# EAGLE design Project (EAGLE 8.7.0)
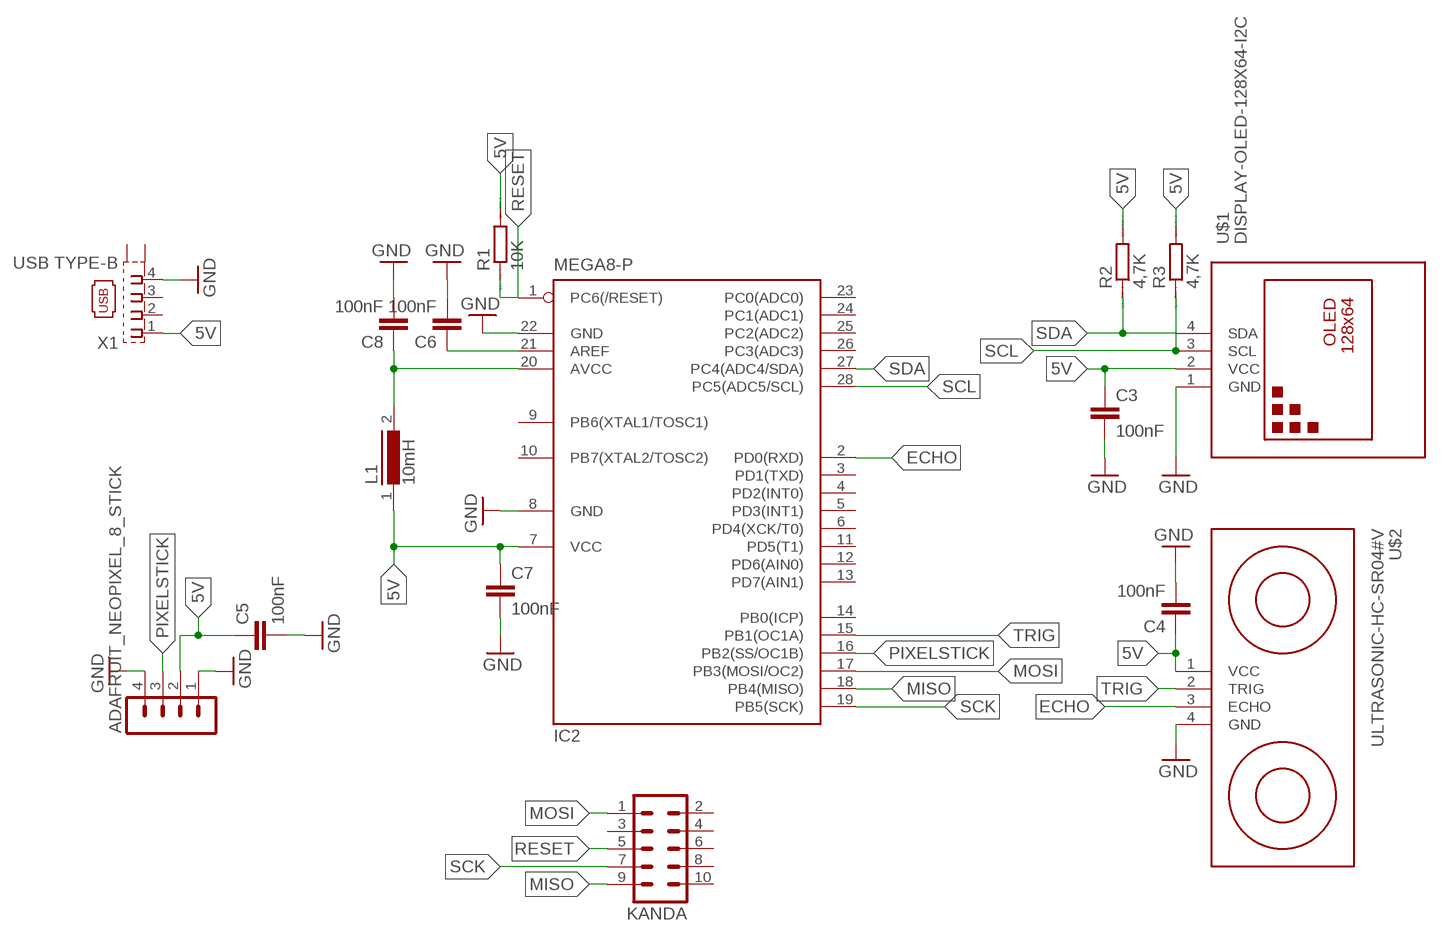
[diagram p0: schematic, sheet 1]

## Parts
ADAFRUIT_NEOPIXEL_8_STICK  MA04-1  [MA04-1]
C3  100nF  C-EU025-024X044  [C025-024X044]
C4  100nF  C-EU025-024X044  [C025-024X044]
C5  100nF  C-EU025-024X044  [C025-024X044]
C6  100nF  C-EU025-024X044  [C025-024X044]
C7  100nF  C-EU025-024X044  [C025-024X044]
C8  100nF  C-EU025-024X044  [C025-024X044]
IC2  MEGA8-P  [DIL28-3]
KANDA  ML10  [ML10]
L1  10mH  A26GFC  [A26GFC]
R1  10K  R  [R0805]
R2  4,7K  R  [R0805]
R3  4,7K  R  [R0805]
U$1  DISPLAY-OLED-128X64-I2C  [DISPLAY-OLED-128X64-I2C]
U$2  ULTRASONIC-HC-SR04#V  [ULTRASONIC-HC-SR04#V]
X1  USB TYPE-B  KUSBVX-BS1N  [KUSBVX-BS1N]

## Nets
5V: ADAFRUIT_NEOPIXEL_8_STICK.2 C3.1 C4.1 C5.1 C7.1 IC2.7(VCC) L1.1 R1.2 R2.2 R3.2 U$1.2(VCC) U$2.1(VCC) X1.1
ECHO: IC2.2(PD0(RXD)) U$2.3(ECHO)
GND: ADAFRUIT_NEOPIXEL_8_STICK.1 ADAFRUIT_NEOPIXEL_8_STICK.4 C3.2 C4.2 C5.2 C6.2 C7.2 C8.2 IC2.8(GND) IC2.22(GND) U$1.1(GND) U$2.4(GND) X1.4
MISO: IC2.18(PB4(MISO)) KANDA.9
MOSI: IC2.17(PB3(MOSI/OC2)) KANDA.1
N$8: C8.1 IC2.20(AVCC) L1.2
N$12: C6.1 IC2.21(AREF)
PIXELSTICK: ADAFRUIT_NEOPIXEL_8_STICK.3 IC2.16(PB2(SS/OC1B))
RESET: IC2.1(PC6(/RESET)) KANDA.5 R1.1
SCK: IC2.19(PB5(SCK)) KANDA.7
SCL: IC2.28(PC5(ADC5/SCL)) R3.1 U$1.3(SCL)
SDA: IC2.27(PC4(ADC4/SDA)) R2.1 U$1.4(SDA)
TRIG: IC2.15(PB1(OC1A)) U$2.2(TRIG)
Unconnected: IC2.3(PD1(TXD)) IC2.4(PD2(INT0)) IC2.5(PD3(INT1)) IC2.6(PD4(XCK/T0)) IC2.9(PB6(XTAL1/TOSC1)) IC2.10(PB7(XTAL2/TOSC2)) IC2.11(PD5(T1)) IC2.12(PD6(AIN0)) IC2.13(PD7(AIN1)) IC2.14(PB0(ICP)) IC2.23(PC0(ADC0)) IC2.24(PC1(ADC1)) IC2.25(PC2(ADC2)) IC2.26(PC3(ADC3)) KANDA.2 KANDA.3 KANDA.4 KANDA.6 KANDA.8 KANDA.10 X1.2 X1.3 X1.M1(S1) X1.M2(S2)

## Library data of the parts
ADAFRUIT_NEOPIXEL_8_STICK = con-lstb:MA04-1: PIN HEADER; OC_FARNELL: unknown; OC_NEWARK: unknown
C3-C8 = rcl:C-EU: CAPACITOR, European symbol; SPICEPREFIX: C
IC2 = atmel:MEGA8-P: MICROCONTROLLER 8 Kbytes FLASH, 1 kbytes SRAM, 512 bytes EEPROM, USART, 4-channel 10 bit ADC, 2-channel 8 bit ADC Pin compatible with Atmega48, ATMega88, ATMega168 Source: avr.lbr; OC_FARNELL: unknown; OC_NEWARK: unknown
KANDA = con-ml:ML10: HARTING; OC_FARNELL: unknown; OC_NEWARK: unknown
L1 = inductors:A26GFC: INDUCTOR; SPICEPREFIX: L
R1-R3 = eagle-ltspice:R: RESISTOR, European symbol; SPICEMODEL: NONE; SPICEPREFIX: R
U$1 = diy-modules:DISPLAY-OLED-128X64-I2C: 128x64 Dot Matrix OLED Module based on SSD1306 chip Variant with I2C interface More details available here: http://www.instructables.com/id/Monochrome-096-i2c-OLED-display-with-arduino-SSD13/ SSD1306 datasheet: https://cdn-shop.adafruit.com/datasheets/SSD1306.pdf Click here to find device on ebay.com <http://www.ebay.com/sch/oled+display+128x64+iic> Note: There are two variants: I2C and SPI. Search for the proper version.
U$2 = diy-modules:ULTRASONIC-HC-SR04: Ultrasonic Ranging Module HC-SR04 More details available here: http://randomnerdtutorials.com/complete-guide-for-ultrasonic-sensor-hc-sr04/ Click here to find device on ebay.com <http://www.ebay.com/sch/hc+sr04+ultrasonic>
X1 = con-kycon:KUSBVX-BS1N: USB B-type Receptacle Vertical, 4 Position, Through Hole Source: Sibalco Kycon KUSBVX-BS1N-xxx.pdf

## Board
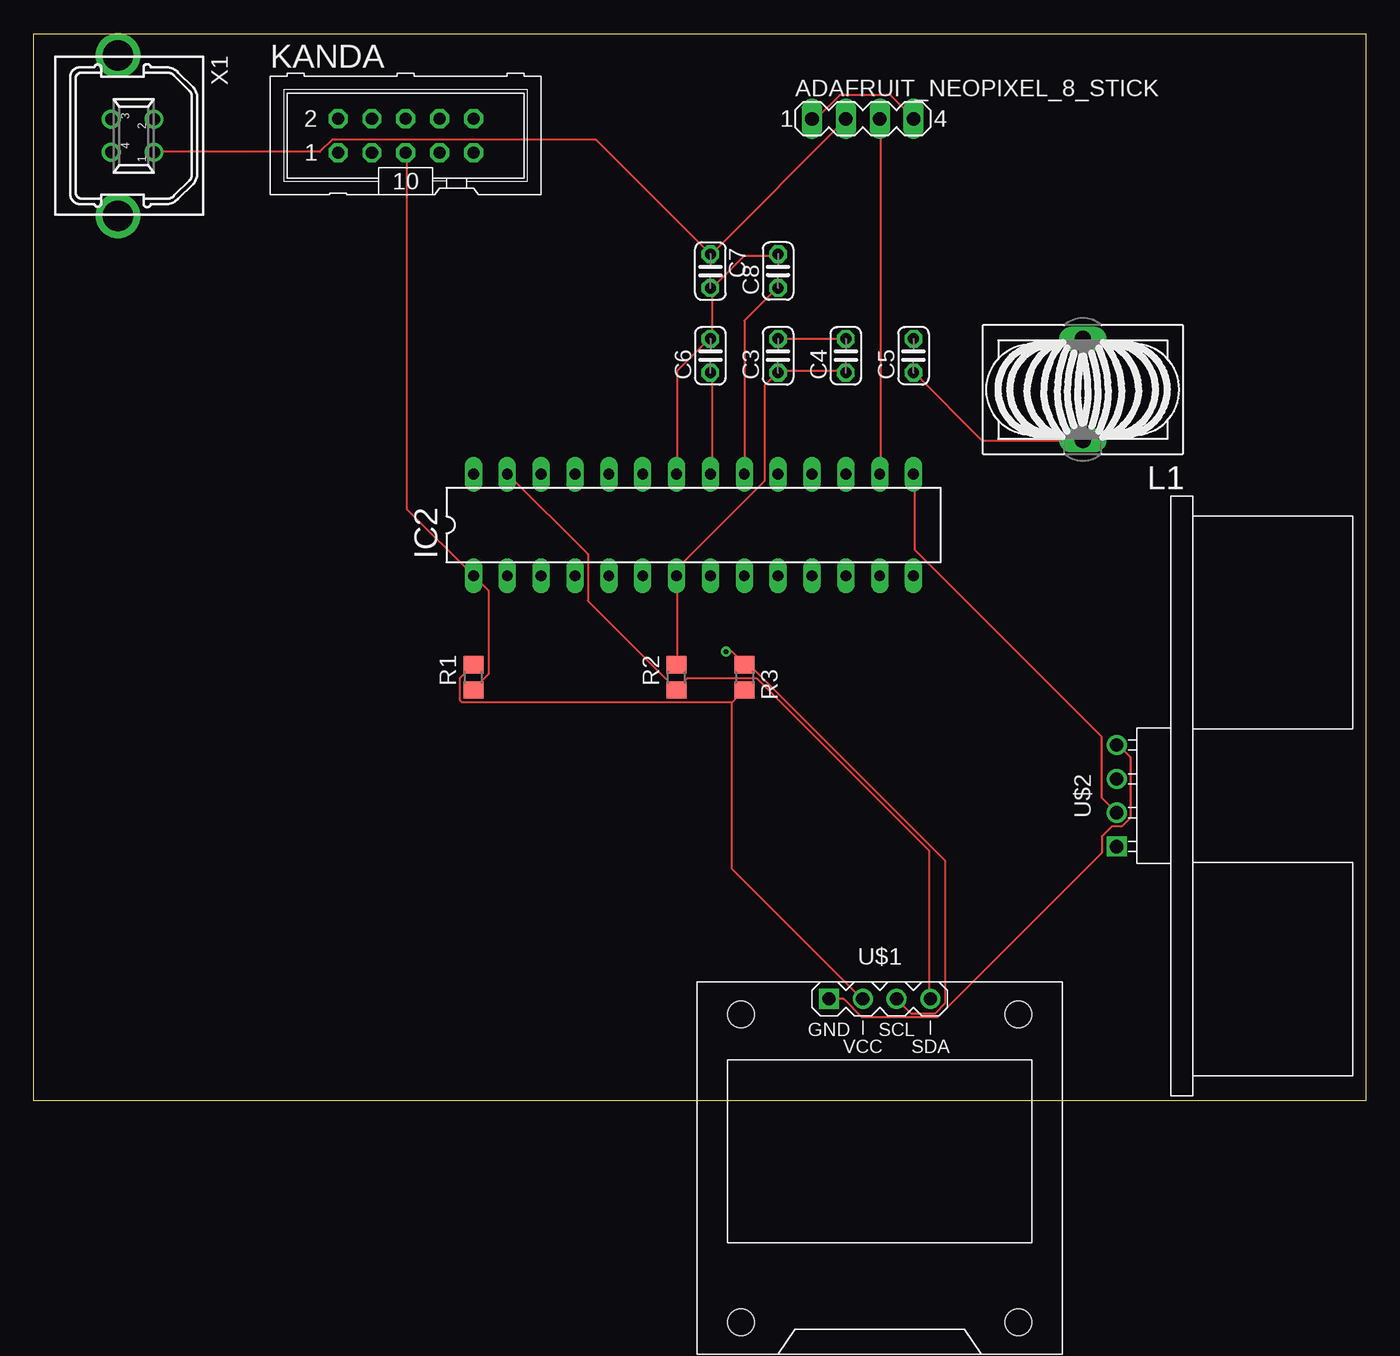
[diagram p1: board, top side]
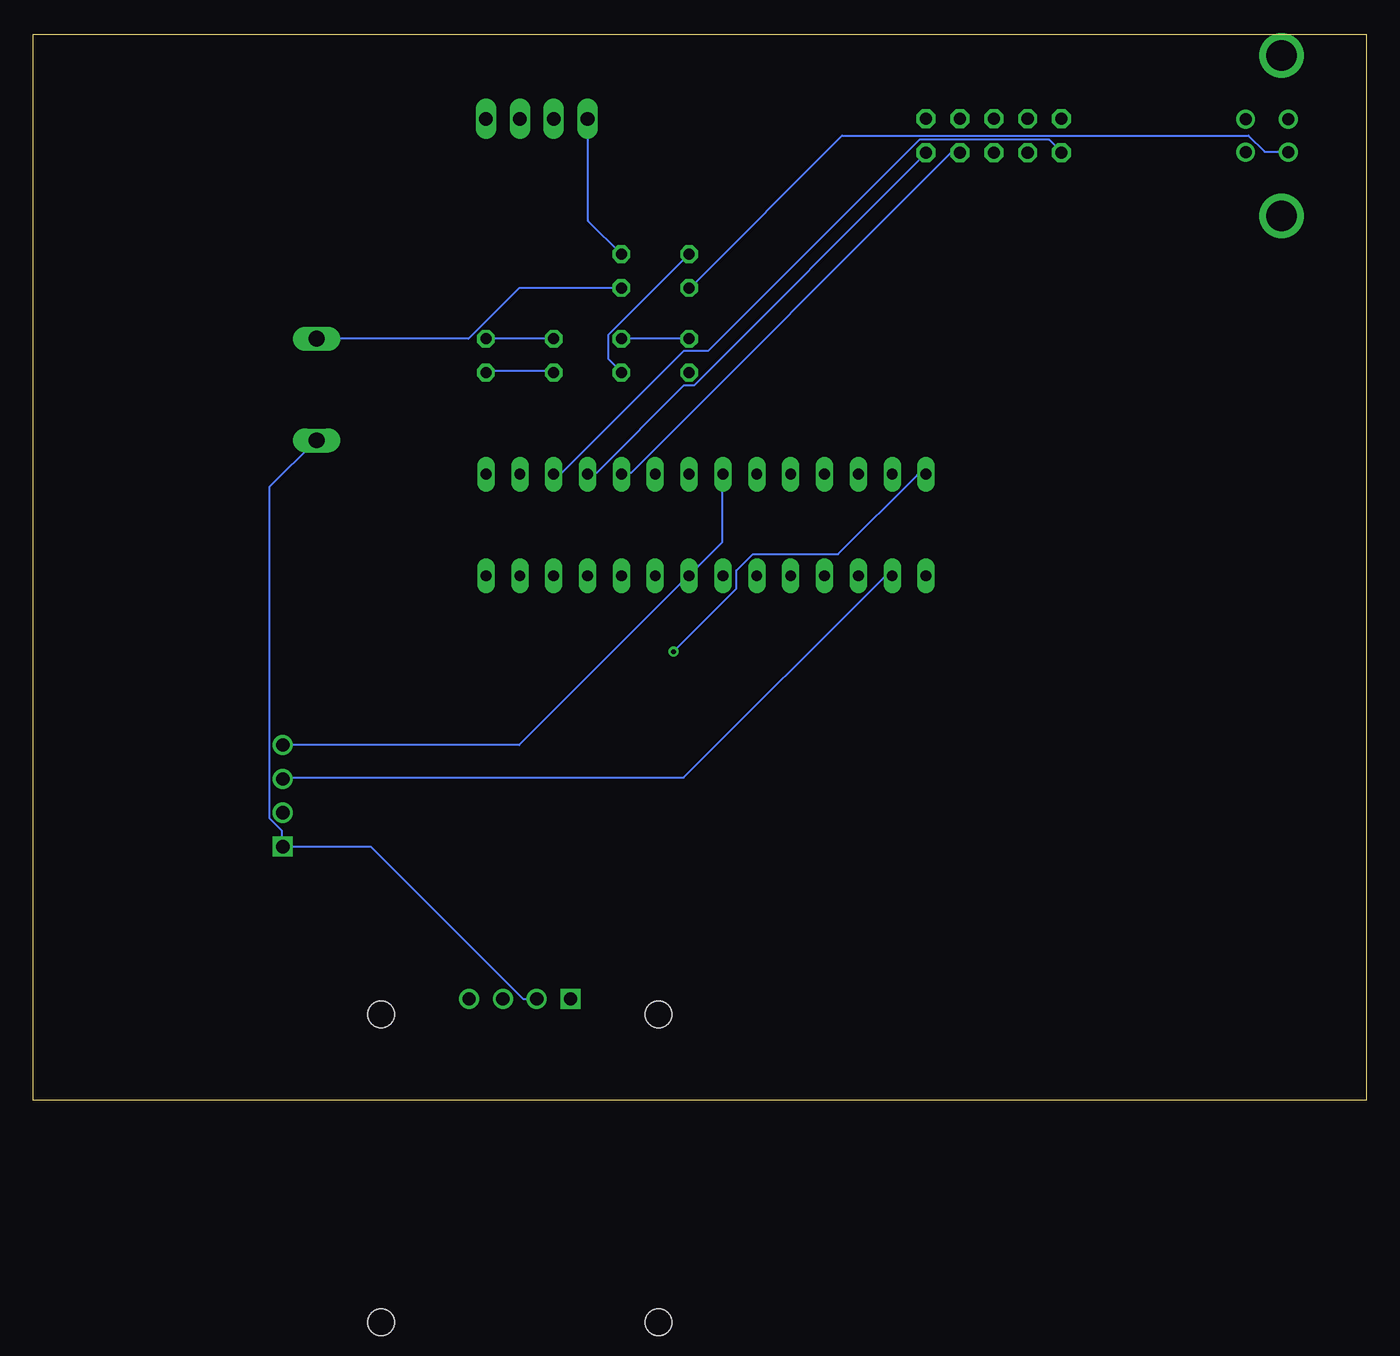
[diagram p2: board, bottom side, seen from below]

Size 100 x 80 mm. Coordinates in mm from the lower left corner, seen from the top.
Outline: 0,0 100,0 100,80 0,80 0,0
Copper layers (1*16): Top 0.035mm / dielectric 1.5mm / Bottom 0.035mm
Design rules "default": minimum track width 6mil, minimum drill 0.35mm, track to track 6mil, track to pad 6mil, pad to pad 6mil, via to via 6mil, smd to smd 6mil, copper to edge 40mil, drill to drill 6mil, minimum pad ring 10mil, minimum via ring 8mil, stop-mask expansion 4mil, vias tented up to drill 0mil, thermal gap 10mil

### Footprints (pad centres in the part's own frame; a part is rotated, then mirrored left to right if it is on the bottom)
MA04-1 = drill 1.016 long: 1 -3.81,0; 2 -1.27,0; 3 1.27,0; 4 3.81,0
C025-024X044 = drill 0.813 octagon: 1 -1.27,0; 2 1.27,0
DIL28-3 = drill 0.813 long: 1 -16.51,-3.81; 2 -13.97,-3.81; 3 -11.43,-3.81; 4 -8.89,-3.81; 5 -6.35,-3.81; 6 -3.81,-3.81; 7 -1.27,-3.81; 8 1.27,-3.81; 9 3.81,-3.81; 10 6.35,-3.81; 11 8.89,-3.81; 12 11.43,-3.81; 13 13.97,-3.81; 14 16.51,-3.81; 15 16.51,3.81; 16 13.97,3.81; 17 11.43,3.81; 18 8.89,3.81; 19 6.35,3.81; 20 3.81,3.81; 21 1.27,3.81; 22 -1.27,3.81; 23 -3.81,3.81; 24 -6.35,3.81; 25 -8.89,3.81; 26 -11.43,3.81; 27 -13.97,3.81; 28 -16.51,3.81
ML10 = drill 0.914 octagon: 1 -5.08,-1.27; 2 -5.08,1.27; 3 -2.54,-1.27; 4 -2.54,1.27; 5 0,-1.27; 6 0,1.27; 7 2.54,-1.27; 8 2.54,1.27; 9 5.08,-1.27; 10 5.08,1.27
A26GFC = drill 1.194 long: 1 0,3.81; 2 0,-3.81
R0805 = smd 1.3 x 1.5: 1 -0.95,0; 2 0.95,0
DISPLAY-OLED-128X64-I2C = drill 1 square: 1 -3.81,12.7 | drill 1: 2 -1.27,12.7; 3 1.27,12.7; 4 3.81,12.7 | hole 2: -10.414,11.557; 10.414,11.557; 10.414,-11.557; -10.414,-11.557
ULTRASONIC-HC-SR04#V = drill 1 square: 1 -3.81,0 | drill 1: 2 -1.27,0; 3 1.27,0; 4 3.81,0
KUSBVX-BS1N = drill 0.9 pad 1.422: 1 1.25,2.7; 2 -1.25,2.7; 3 -1.25,-0.5; 4 1.25,-0.5 | drill 2.3 pad 2.7: M1 -6.02,0; M2 6.02,0

### Placement (x,y rotation side)
ADAFRUIT_NEOPIXEL_8_STICK  62.23,73.66 0 top
C3  55.88,55.88 90 top
C4  60.96,55.88 90 top
C5  66.04,55.88 90 top
C6  50.8,55.88 90 top
C7  50.8,62.23 270 top
C8  55.88,62.23 90 top
IC2  49.53,43.18 0 top
KANDA  27.94,72.39 0 top
L1  78.74,53.34 180 top
R1  33.02,31.75 90 top
R2  48.26,31.75 90 top
R3  53.34,31.75 270 top
U$1  63.5,-5.08 0 top
U$2  81.28,22.86 90 top
X1  6.35,72.39 270 top

### Tracks (layer width: path | path; a pad name or v marks a point on that pad's centre or on a via)
5V
  Top 0.152: 52.43,29.87 32.16,29.87 32,30.02 32,31.7 32.92,32.61 R1.2 | 52.43,29.87 53.34,30.79 R3.2 | 52.43,29.87 52.43,17.37 62.18,7.62 U$1.2 | R2.2 48.31,32.77 48.31,39.32 IC2.7 48.31,39.47 48.31,39.93 54.86,46.48 54.86,53.65 55.78,54.56 C3.1 55.93,54.71 60.96,54.71 C4.1 | X1.1 9.14,71.17 21.49,71.17 22.4,72.08 42.22,72.08 C7.1 50.9,63.55 60.96,73.61 ADAFRUIT_NEOPIXEL_8_STICK.2 | L1.1 71.17,49.53 66.14,54.56 C5.1
  Bottom 0.152: U$1.2 63.25,7.62 74.68,19.05 U$2.1 81.38,19.05 81.38,20.27 82.3,21.18 82.3,46.02 78.79,49.53 L1.1 | C7.1 56.84,57.45 56.84,55.63 55.93,54.71 C3.1 | C5.1 65.99,54.71 60.96,54.71 C4.1
ECHO
  Bottom 0.152: IC2.2 35.66,39.32 36.12,39.32 51.21,24.23 81.23,24.23 U$2.3
GND
  Top 0.152: U$1.1 60.81,7.62 62.18,6.25 67.82,6.25 80.16,18.59 80.16,19.81 80.92,20.57 81.69,20.57 82.3,21.18 82.3,25.76 81.38,26.67 U$2.4 | ADAFRUIT_NEOPIXEL_8_STICK.1 58.52,73.76 58.83,73.76 60.5,75.44 64.31,75.44 65.99,73.76 ADAFRUIT_NEOPIXEL_8_STICK.4 | 50.9,60.96 50.9,57.15 C6.2 50.75,57.15 48.31,54.71 48.31,47.09 IC2.22 | 50.9,60.96 53.34,63.4 55.78,63.4 C8.2 | 50.9,60.96 C7.2 | C3.2 C4.2
  Bottom 0.152: IC2.22 48.31,46.94 48.31,41.91 50.75,39.47 IC2.8 50.9,39.32 63.55,26.67 U$2.4 | C6.2 C3.2 | C4.2 C5.2 | X1.4 5.94,71.17 7.62,71.17 8.84,72.39 39.32,72.39 50.75,60.96 C7.2 | C8.2 58.37,65.99 58.37,73.61 ADAFRUIT_NEOPIXEL_8_STICK.1
MISO
  Bottom 0.152: IC2.18 58.37,47.09 57.76,47.09 51.21,53.65 50.44,53.65 33.07,71.02 KANDA.9
MOSI
  Bottom 0.152: IC2.17 60.96,47.09 60.35,47.09 51.21,56.24 49.38,56.24 33.53,72.08 23.77,72.08 22.86,71.17 KANDA.1
N$8
  Top 0.152: IC2.20 53.34,58.52 55.78,60.96 C8.1
  Bottom 0.152: L1.2 67.36,57.15 63.55,60.96 C8.1
N$12
  Top 0.152: IC2.21 50.9,47.09 50.9,54.56 C6.1
PIXELSTICK
  Top 0.152: IC2.16 63.55,47.09 63.55,73.61 ADAFRUIT_NEOPIXEL_8_STICK.3
RESET
  Top 0.152: R1.1 33.07,30.94 34.14,32 34.14,38.25 IC2.1 28.04,44.35 28.04,71.02 KANDA.5
SCK
  Bottom 0.152: IC2.19 55.78,47.09 55.17,47.09 31.24,71.02 30.48,71.02 KANDA.7
SCL  (via drill 0.35)
  Top 0.152: U$1.3 65.84,6.55 67.67,6.55 68.43,7.32 68.43,17.98 53.8,32.61 53.34,32.61 R3.1 53.34,32.77 52.43,33.68 v51.97,33.68
  Bottom 0.152: v51.97,33.68 47.24,38.41 47.24,39.78 46.02,41 39.62,41 33.68,46.94 33.07,46.94 IC2.28
SDA
  Top 0.152: IC2.27 35.66,46.94 41.6,41 41.6,37.49 48.16,30.94 R2.1 48.31,30.94 49.07,31.7 54.25,31.7 67.21,18.75 67.21,7.62 U$1.4
TRIG
  Top 0.152: U$2.2 80.16,22.71 80.16,27.28 66.14,41.3 66.14,46.94 IC2.15